# EasyEDA Pro project kuafu02_NI高低温板.eprj, schematic Schematic1
Create Date: 2023-06-19; Page Name: P1; Project Name: kuafu02_NI高低温板; Schematic Name: Schematic1; Update Date: 2023-06-25; Company: 嘉立创EDA; Page Size: A4; Version: V1.0
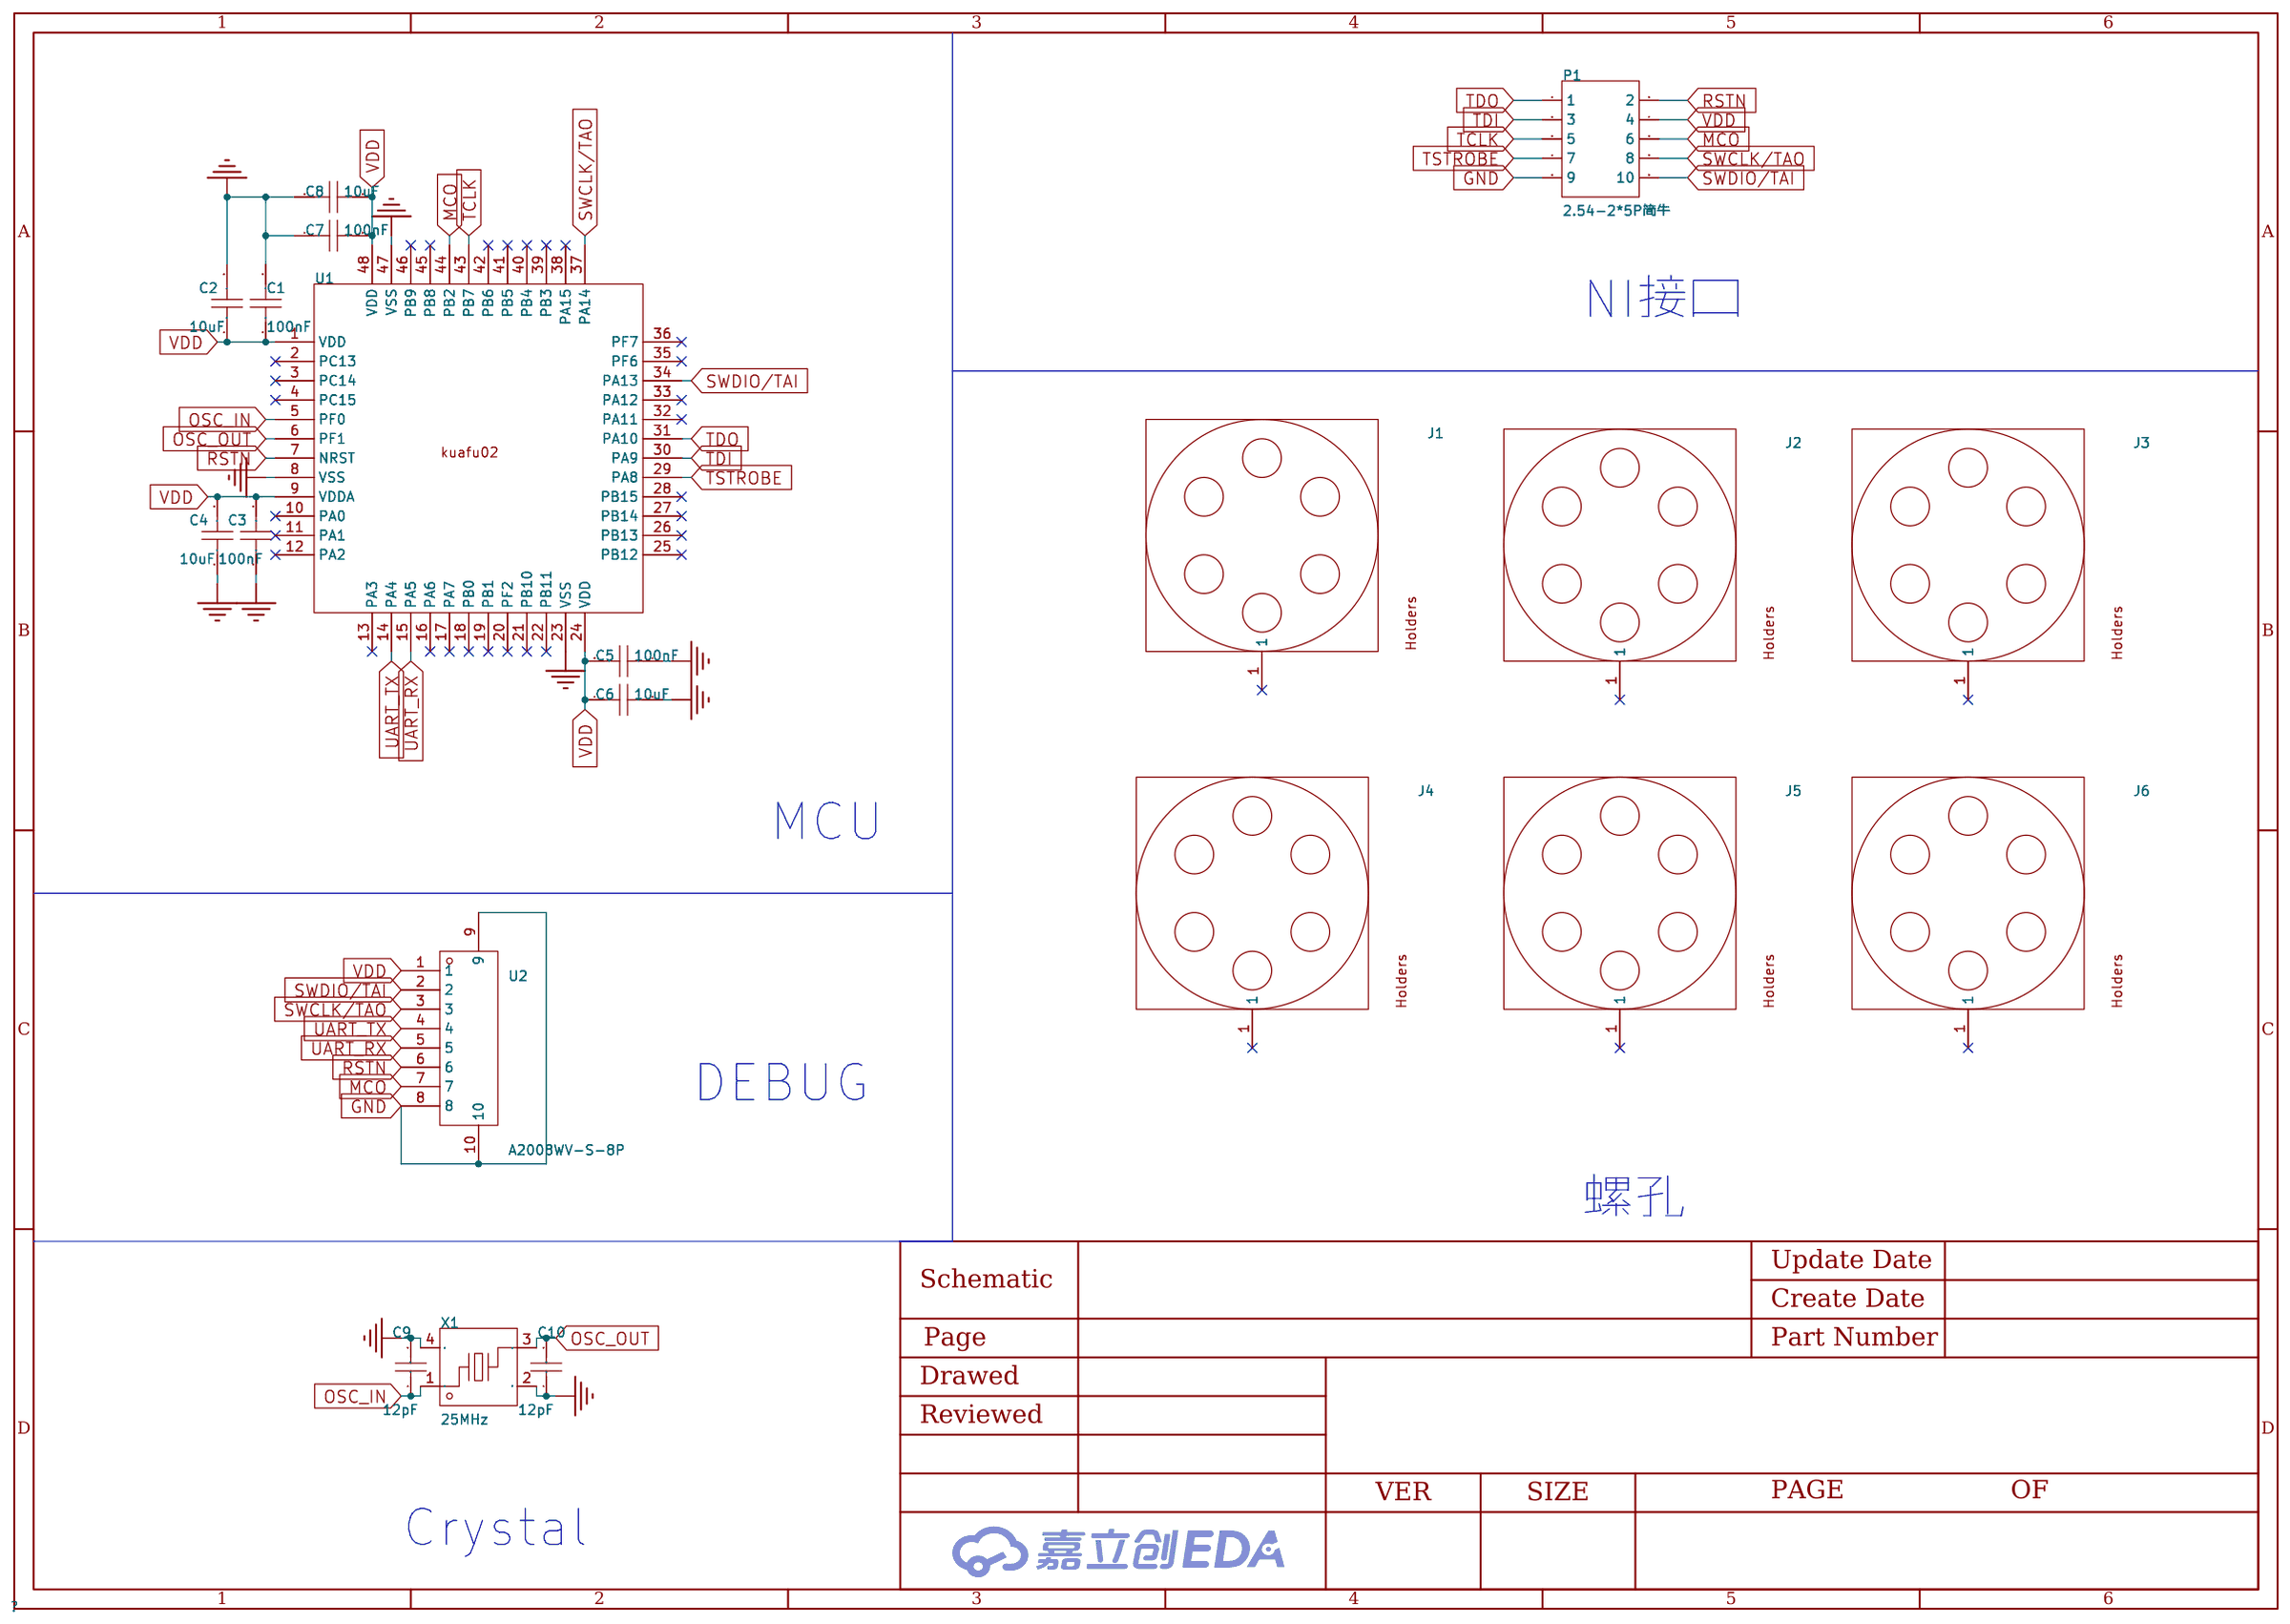
[diagram p0: schematic sheet]

## Parts
C1  100nF  [C0603]
C2  10uF  [C0603]
C3  100nF  [C0603]
C4  10uF  [C0603]
C5  100nF  [C0603]
C6  10uF  [C0603]
C7  100nF  [C0603]
C8  10uF  [C0603]
C9  12pF  [C0603]
C10  12pF  [C0603]
J1  -  [DEMO板安装孔]
J2  -  [DEMO板安装孔]
J3  -  [DEMO板安装孔]
J4  -  [DEMO板安装孔]
J5  -  [DEMO板安装孔]
J6  -  [DEMO板安装孔]
P1  2.54-2*5P简牛  [IDC-TH_10P-P2.54_C5665]
U1  -  [LQFP-48_L7.0-W7.0-P0.50-LS9.0-BL]
U2  A2008WV-S-8P  [CONN-SMD_A2008WV-S-8P]
X1  25MHz  [CRYSTAL-SMD_4P-L3.2-W2.5-BL]

## Library data of the parts
C1 C3 C5 C7 = CC0603KRX7R9BB104: 容值:100nF;精度:±10%;额定电压:50V;材质(温度系数):X7R;; LCSC Part Name: 100nF ±10% 50V; Supplier Part: C14663; Manufacturer: YAGEO(国巨); Supplier Footprint: 0603; JLCPCB Part Class: Basic Part; Datasheet: https://atta.szlcsc.com/upload/public/pdf/source/20180910/C282072_33301C7F631E79921B82A8DAC6BCC5B3.pdf; Supplier: LCSC; Tolerance: ±10%; Voltage Rated: 50V; Temperature Coefficient: X7R
C2 C4 C6 C8 = CL10A106KP8NNNC: 容值:10uF;精度:±10%;额定电压:10V;材质(温度系数):X5R;; LCSC Part Name: 10uF ±10% 10V; Supplier Part: C19702; Manufacturer: SAMSUNG(三星); Supplier Footprint: 0603; JLCPCB Part Class: Basic Part; Datasheet: https://atta.szlcsc.com/upload/public/pdf/source/20160103/1457707703378.pdf; Supplier: LCSC; Tolerance: ±10%; Voltage Rated: 10V; Temperature Coefficient: X5R
C9 C10 = CL10C120JB8NNNC: 容值:12pF;精度:±5%;额定电压:50V;材质(温度系数):C0G;; LCSC Part Name: 12pF ±5% 50V; Supplier Part: C38523; Manufacturer: SAMSUNG(三星); Supplier Footprint: 0603; JLCPCB Part Class: Basic Part; Datasheet: https://atta.szlcsc.com/upload/public/pdf/source/20160103/1457707725436.pdf; Supplier: LCSC; Tolerance: ±5%; Voltage Rated: 50V; Temperature Coefficient: C0G
J1-J6 = 螺孔_3.1X6MM
P1 = 2.54-2*5P简牛: 连接器类型:简牛座;每排PIN数:5;排数:2;间距:2.54mm;行距:2.54mm;封装形式:直插;触头材质:-;触头镀层:-;; LCSC Part Name: 每排P数:5 排数:2 2.54mm; Supplier Part: C5665; Manufacturer: BOOMELE(博穆精密); Supplier Footprint: 插件,P=2.54mm; JLCPCB Part Class: Extended Part; Datasheet: https://atta.szlcsc.com/upload/public/pdf/source/20140331/1457707037896.pdf; Supplier: LCSC; Connector Type: 简牛座; Pin Number in each Row: 5; Number of Rows: 2; Pitch: 2.54mm; Row Spacing: 2.54mm; Holder Type: 直插
U1 = kuafu02
U2 = A2008WV-S-8P: 参考系列:PH;间距:2mm;插针结构:1x8P;排数:1;每排PIN数:8;行距:-;安装方式:-;触头材质:黄铜;; LCSC Part Name: PH 2mm 1x8P 镀锡; Supplier Part: C273128; Manufacturer: CJT(长江连接器); Supplier Footprint: SMD,P=2mm; JLCPCB Part Class: Extended Part; Datasheet: https://atta.szlcsc.com/upload/public/pdf/source/20180913/C273128_BB1852F7672CD820F7AD4E26555E7BEC.pdf; Supplier: LCSC; Reference Series: PH; Pitch: 2mm; Pins Structure: 1x8P; Number of Rows: 1; Number of PINs Per Row: 8; Contact Material: 黄铜
X1 = XC322525MOB4SA-18: 频率:25MHz;频率公差:10ppm;负载电容:12pF;; LCSC Part Name: 25MHZ 12PF 10PPM YSX321SC YSX321SC; Supplier Part: C3294350; Manufacturer: YXC(扬兴晶振); Supplier Footprint: SMD3225-4P; JLCPCB Part Class: Extended Part; Datasheet: https://atta.szlcsc.com/upload/public/pdf/source/20220629/716BAE50E7919964DDA8D15FD40F3478.pdf; Supplier: LCSC; Crystal Type: 贴片无源晶振; Frequency Tolerance: 10ppm; Load Capacitance: 12pF; Operating Temperature: -40℃~125℃

## Nets
GND: C1.2 C2.2 C3.1 C4.1 C5.1 C6.2 C7.1 C8.2 C9.2 C10.1 P1.9 U1.8(VSS) U1.23(VSS) U1.47(VSS) U2.8 U2.9 U2.10 X1.2(GND) X1.4(GND)
VDD: C1.1 C2.1 C3.2 C4.2 C5.2 C6.1 C7.2 C8.1 P1.4 U1.1(VDD) U1.9(VDDA) U1.24(VDD) U1.48(VDD) U2.1
MCO: P1.6 U1.44(PB2) U2.7
OSC_IN: C9.1 U1.5(PF0) X1.1
OSC_OUT: C10.2 U1.6(PF1) X1.3
RSTN: P1.2 U1.7(NRST) U2.6
SWCLK/TAO: P1.8 U1.37(PA14) U2.3
SWDIO/TAI: P1.10 U1.34(PA13) U2.2
TCLK: P1.5 U1.43(PB7)
TDI: P1.3 U1.30(PA9)
TDO: P1.1 U1.31(PA10)
TSTROBE: P1.7 U1.29(PA8)
UART_RX: U1.15(PA5) U2.5
UART_TX: U1.14(PA4) U2.4

Not connected (* = marked no-connect by the designer): J1 1*; J2 1*; J3 1*; J4 1*; J5 1*; J6 1*; U1 2(PC13)* 3(PC14)* 4(PC15)* 10(PA0)* 11(PA1)* 12(PA2)* 13(PA3)* 16(PA6)* 17(PA7)* 18(PB0)* 19(PB1)* 20(PF2)* 21(PB10)* 22(PB11)* 25(PB12)* 26(PB13)* 27(PB14)* 28(PB15)* 32(PA11)* 33(PA12)* 35(PF6)* 36(PF7)* 38(PA15)* 39(PB3)* 40(PB4)* 41(PB5)* 42(PB6)* 45(PB8)* 46(PB9)*

## Notes on the sheet
- NI接口
- MCU
- DEBUG
- 螺孔
- Crystal
